# Altium schematic sheet altium_kicad.SchDoc
size A4
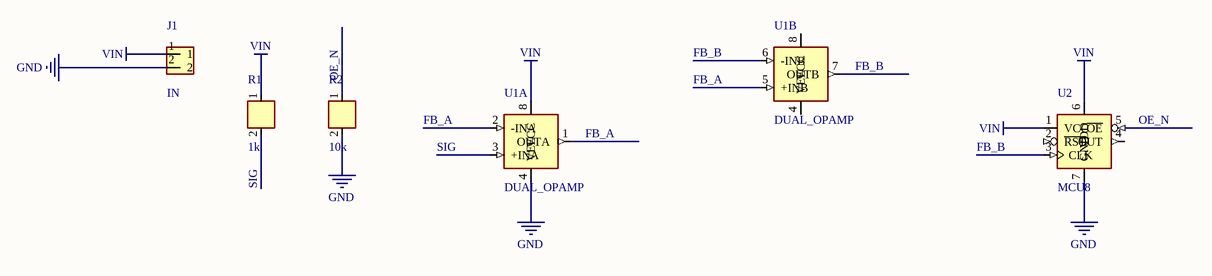
[diagram p0: altium_kicad.SchDoc]

## Parts
J1  IN  [PinHeader_1x02]
R1  1k  [R0603]
R2  10k  [R0603]
U1  DUAL_OPAMP  [SOIC8]  (parts A,B of 2)
U2  MCU8  [SOIC8]

## Nets
GND: J1.2 R2.2 U1.4(VEE) U2.7(GND)
VIN: J1.1 R1.1 U1.8(VCC) U2.1(VCC) U2.6(VDD)
FB_A: U1.1(OUTA) U1.2(-INA) U1.5(+INB)
FB_B: U1.6(-INB) U1.7(OUTB) U2.3(CLK)
OE_N: R2.1 U2.5(~{OE})
SIG: R1.2 U1.3(+INA)

Not connected (* = marked no-connect by the designer): U2 2(~{RST}) 4(OUT) 8(TP)

## Library data of the parts
J1 = CONN2
R1 R2 = R_V